# Altium schematic sheet TB-OSW-DRV V1.0.SchDoc
size D
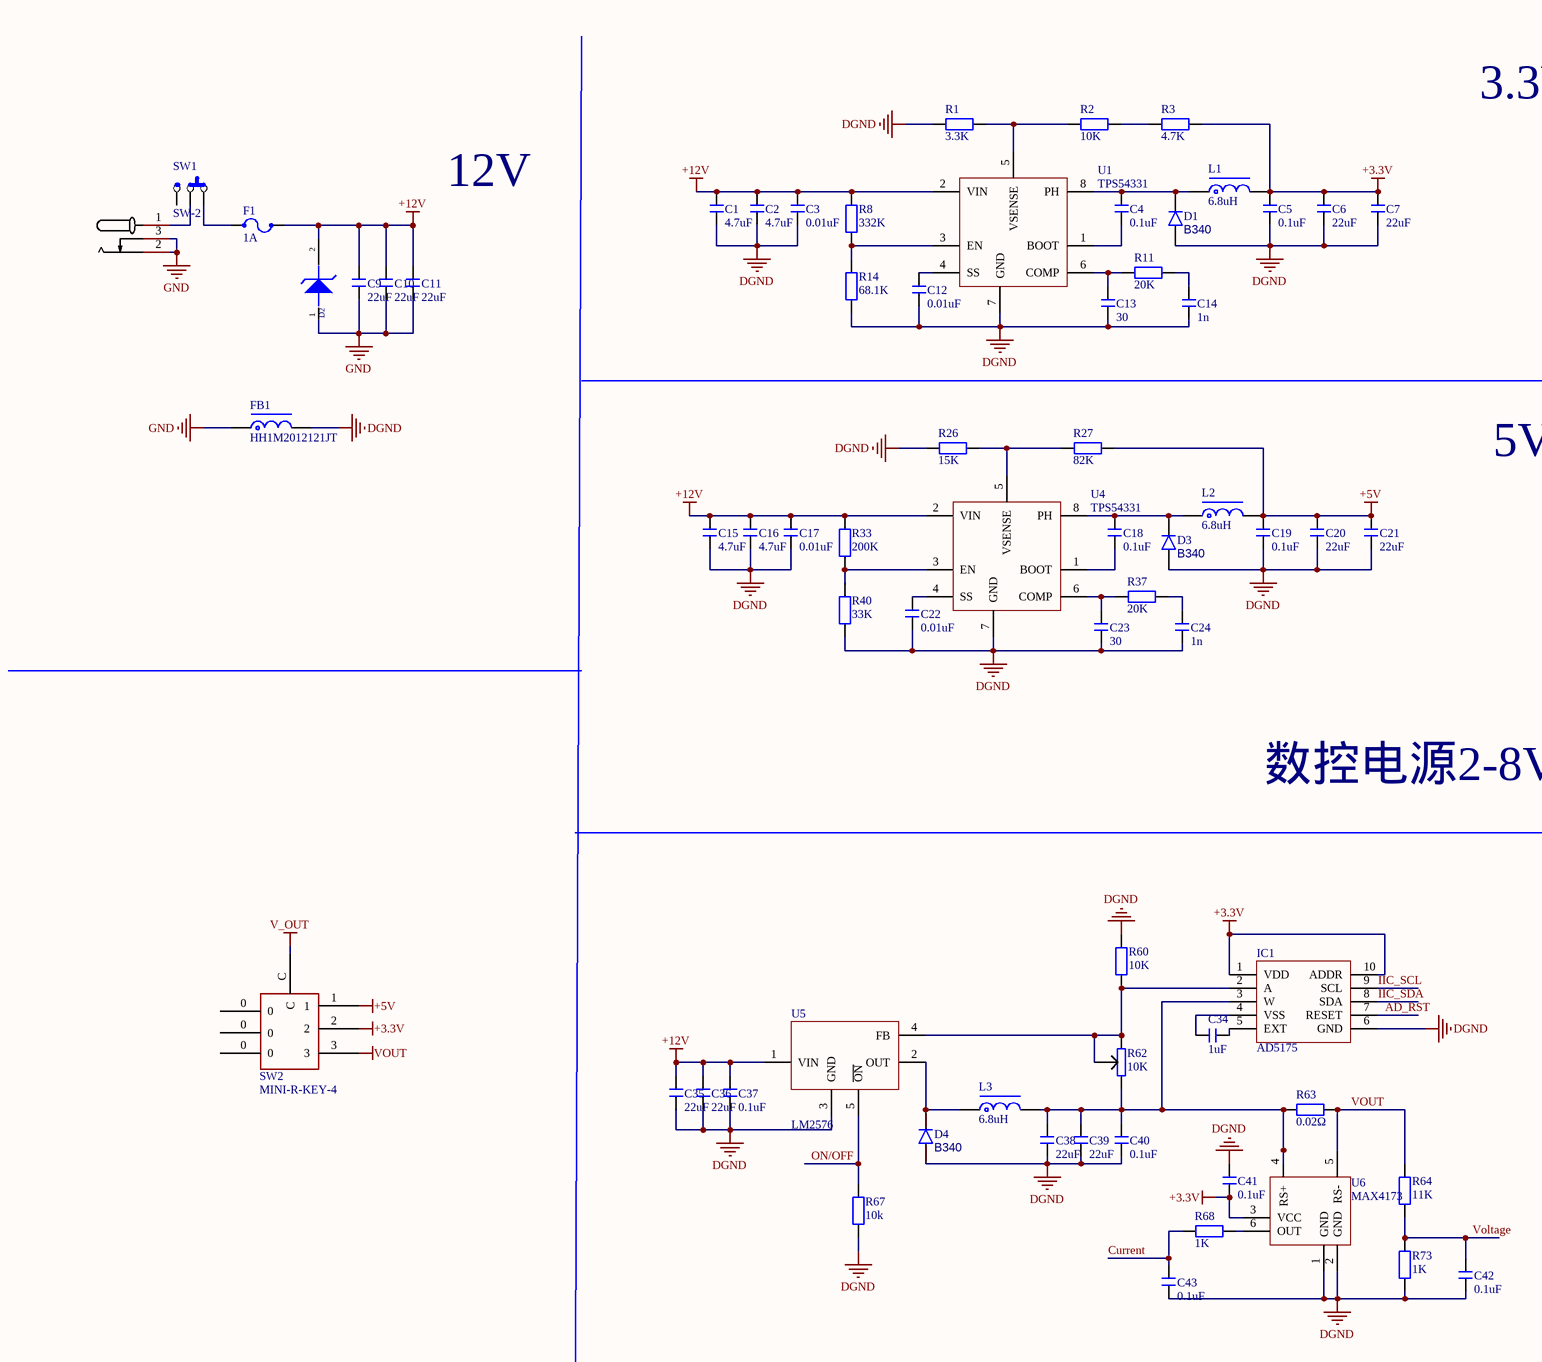
[diagram p0: TB-OSW-DRV V1.0.SchDoc, top left]
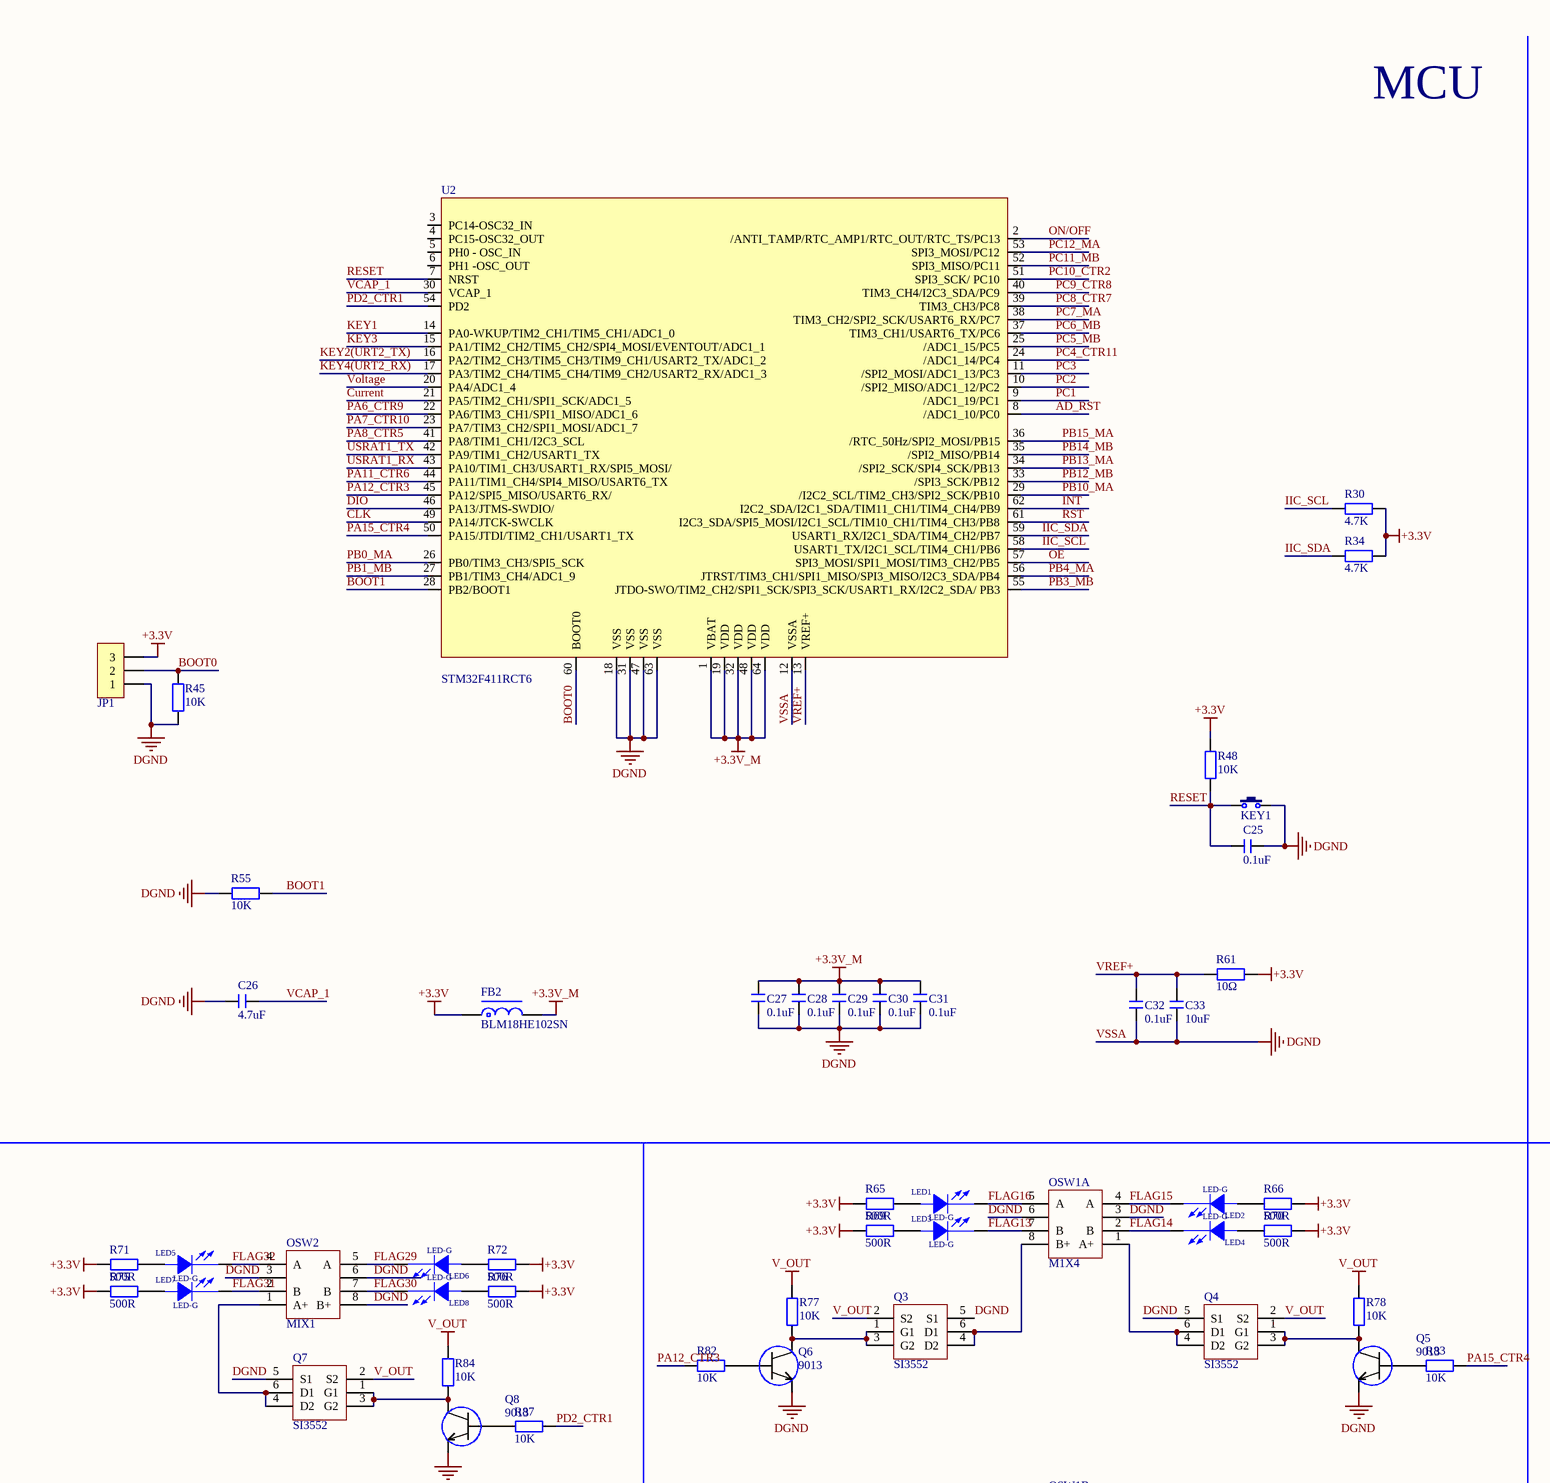
[diagram p1: TB-OSW-DRV V1.0.SchDoc, top middle]
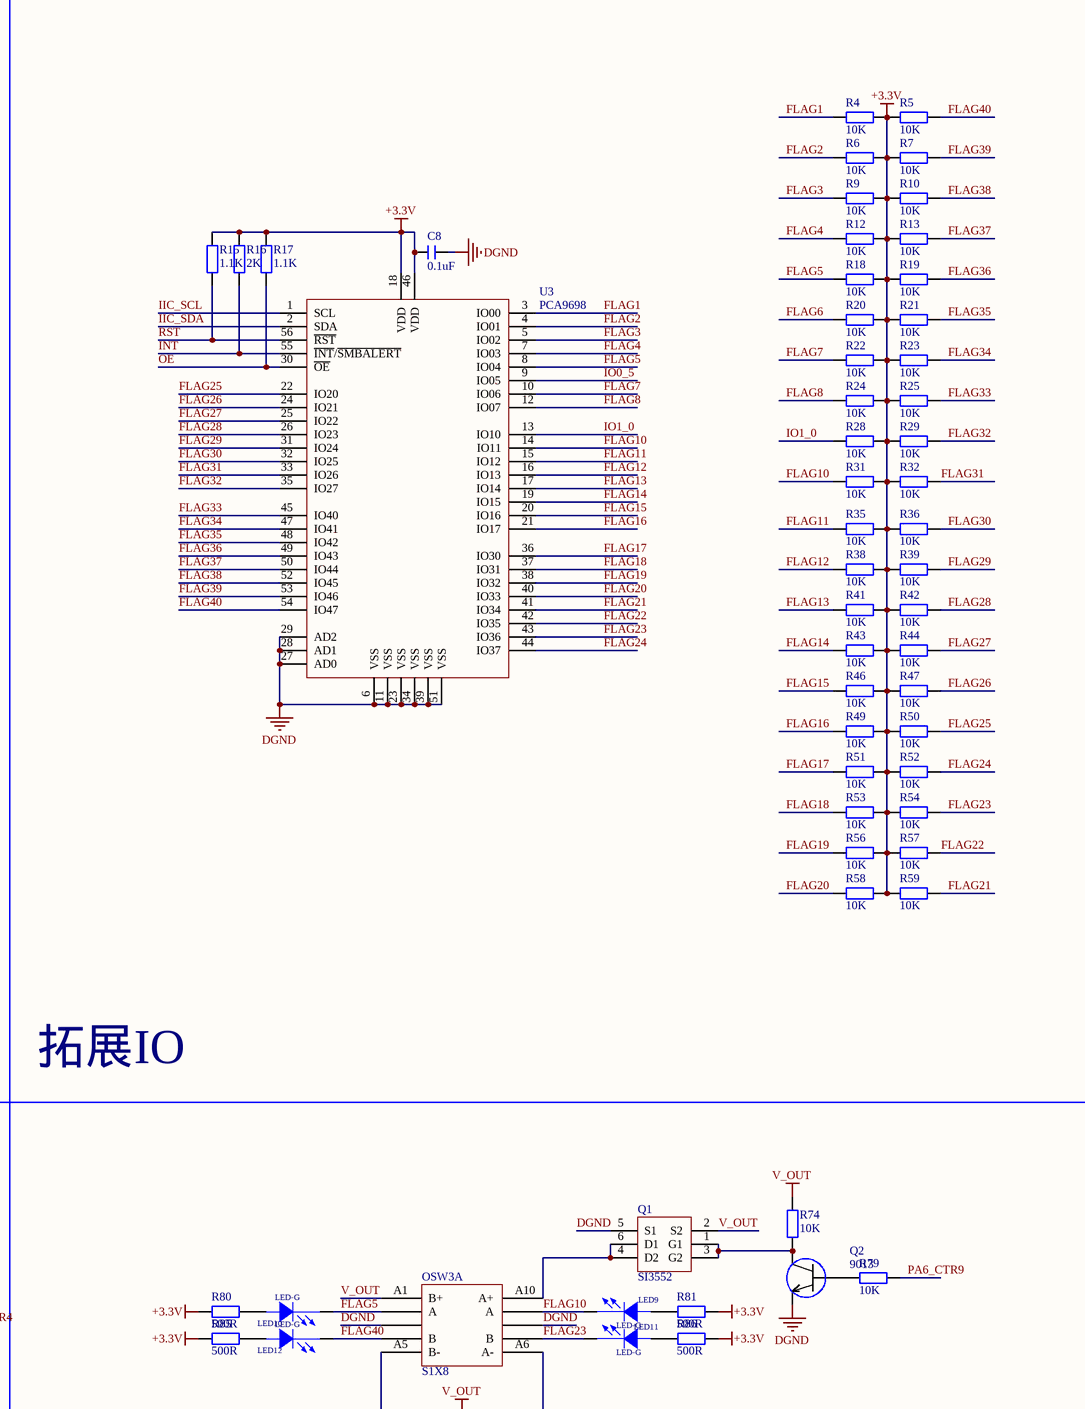
[diagram p2: TB-OSW-DRV V1.0.SchDoc, top right]
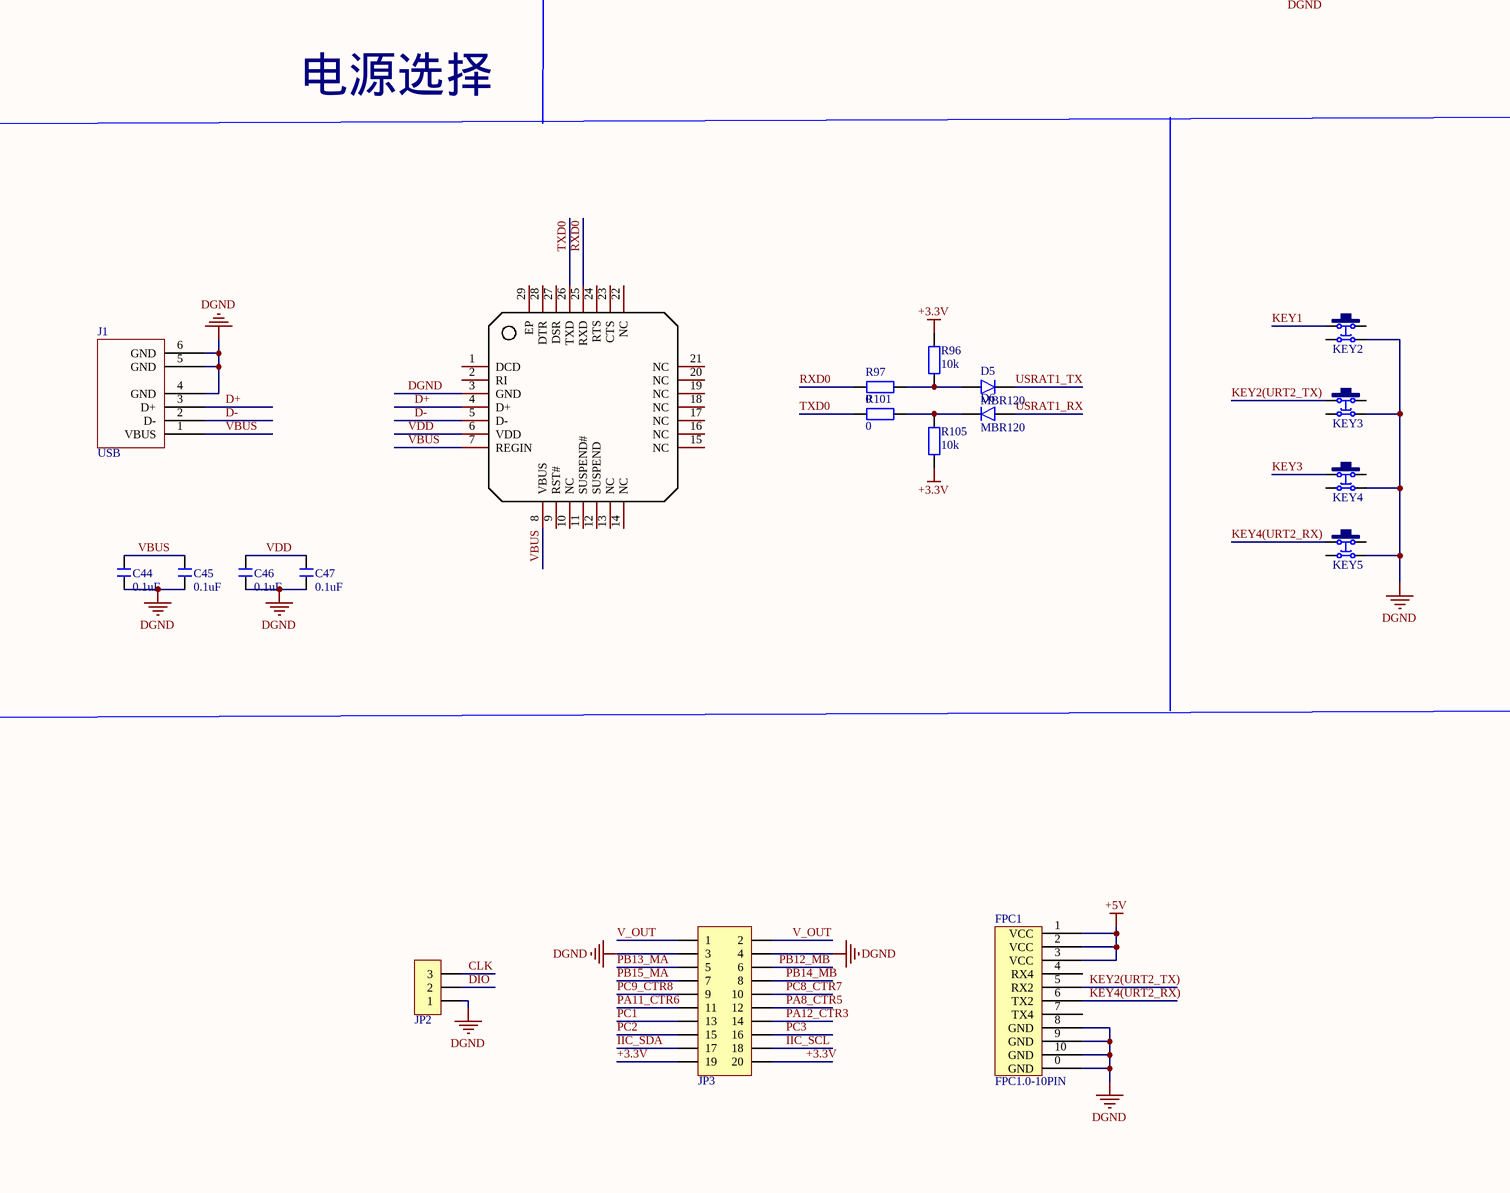
[diagram p3: TB-OSW-DRV V1.0.SchDoc, bottom left]
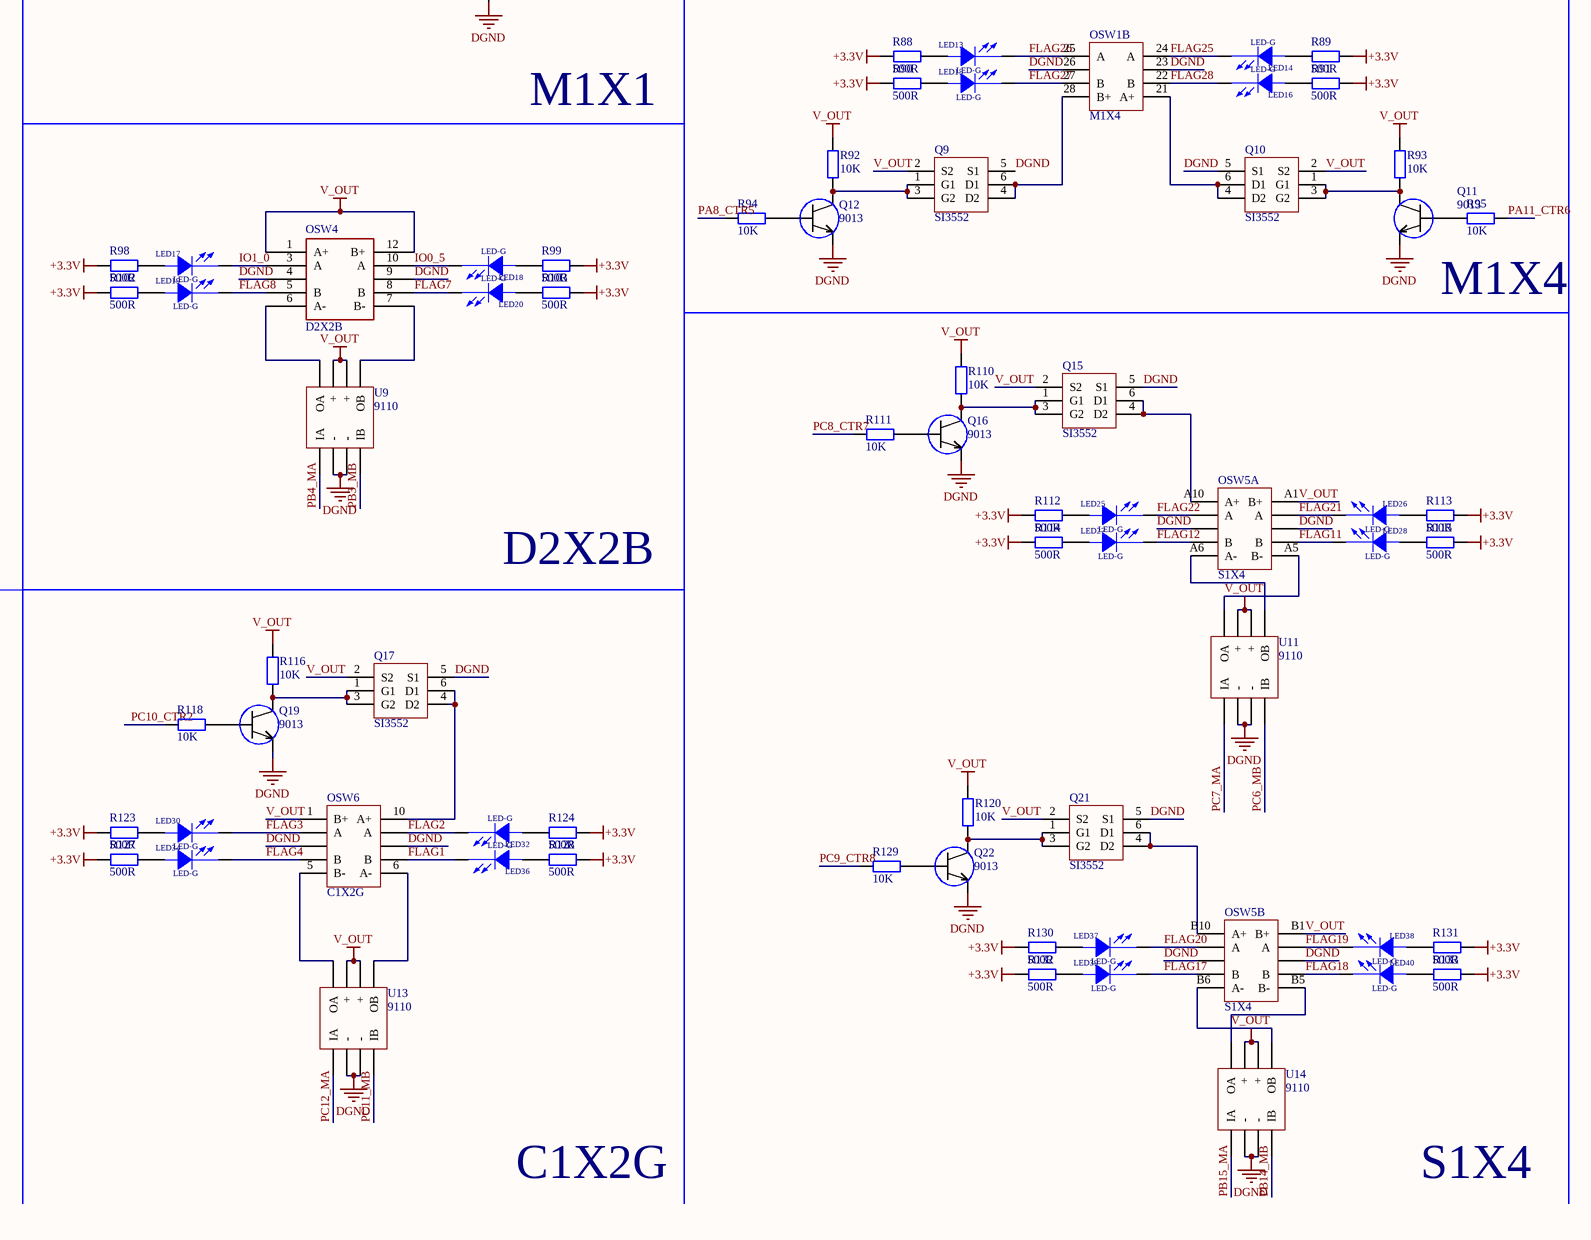
[diagram p4: TB-OSW-DRV V1.0.SchDoc, bottom middle]
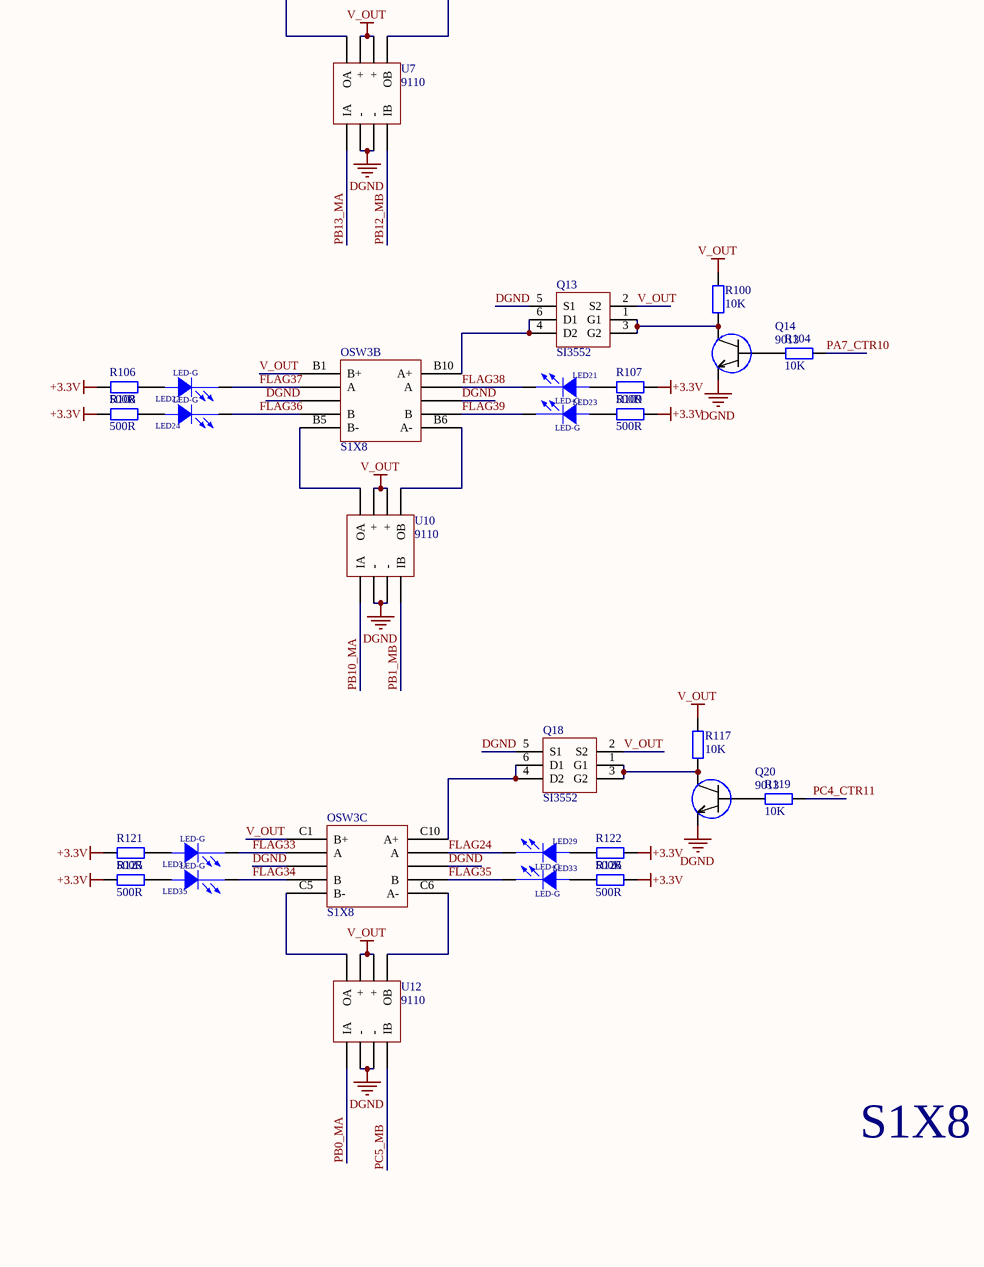
[diagram p5: TB-OSW-DRV V1.0.SchDoc, bottom right]

## Parts
C1  4.7uF  [C 0805]
C2  4.7uF  [C 0805]
C3  0.01uF  [C 0805]
C4  0.1uF  [C 0603]
C5  0.1uF  [C 0603]
C6  22uF  [C 0805]
C7  22uF  [C 0805]
C8  0.1uF  [C 0603]
C9  22uF  [C 1206]
C10  22uF  [C 1206]
C11  22uF  [C 1206]
C12  0.01uF  [C 0603]
C13  30  [C 0603]
C14  1n  [C 0603]
C15  4.7uF  [C 0805]
C16  4.7uF  [C 0805]
C17  0.01uF  [C 0805]
C18  0.1uF  [C 0603]
C19  0.1uF  [C 0603]
C20  22uF  [C 0805]
C21  22uF  [C 0805]
C22  0.01uF  [C 0603]
C23  30  [C 0603]
C24  1n  [C 0603]
C25  0.1uF  [C 0603]
C26  4.7uF  [C 0603]
C27  0.1uF  [C 0603]
C28  0.1uF  [C 0603]
C29  0.1uF  [C 0603]
C30  0.1uF  [C 0603]
C31  0.1uF  [C 0603]
C32  0.1uF  [C 0603]
C33  10uF  [C 0603]
C34  1uF  [C 0603]
C35  22uF  [C 1206]
C36  22uF  [C 1206]
C37  0.1uF  [C 0603]
C38  22uF  [C 0805]
C39  22uF  [C 0805]
C40  0.1uF  [C 0603]
C41  0.1uF  [C 0603]
C42  0.1uF  [C 0603]
C43  0.1uF  [C 0603]
C44  0.1uF  [C 0603]
C45  0.1uF  [C 0603]
C46  0.1uF  [C 0603]
C47  0.1uF  [C 0603]
D1  B340  [d1808]
D2  TVS_SDO5C_SOD-323  [SOD-323]  (value not drawn)
D3  B340  [d1808]
D4  B340  [d1808]
D5  MBR120  [SOD-123]
D6  MBR120  [SOD-123]
DC1  DC005  [DC-IN-TH_DC005]  (value not drawn)
F1  1A  [R1206]
FB1  HH1M2012121JT  [L 0805]
FB2  BLM18HE102SN  [L 0805]
FPC1  FPC1.0-10PIN  [FPC1.0-2H-WS-10P]
IC1  AD5175  [AD5175]
J1  USB  [USB-B]
JP1  HDR-1X3  [HDR-1X3]  (value not drawn)
JP2  HDR-1X3  [HDR-1X3]  (value not drawn)
JP3  Header 2X10  [HDR-10X2]  (value not drawn)
KEY1  3x6x5  [TSW SMD-3*6*2.5]  (value not drawn)
KEY2  12x12x5  [TSW DIP-12*12*11]  (value not drawn)
KEY3  12x12x5  [TSW DIP-12*12*11]  (value not drawn)
KEY4  12x12x5  [TSW DIP-12*12*11]  (value not drawn)
KEY5  12x12x5  [TSW DIP-12*12*11]  (value not drawn)
L1  6.8uH  [CD54]
L2  6.8uH  [CD54]
L3  6.8uH  [CD54]
LED1  value LED-G  [D0603B]  (hidden comment: D_LED-G_D0603)
LED2  value LED-G  [D0603B]  (hidden comment: D_LED-G_D0603)
LED3  value LED-G  [D0603B]  (hidden comment: D_LED-G_D0603)
LED4  value LED-G  [D0603B]  (hidden comment: D_LED-G_D0603)
LED5  value LED-G  [D0603B]  (hidden comment: D_LED-G_D0603)
LED6  value LED-G  [D0603B]  (hidden comment: D_LED-G_D0603)
LED7  value LED-G  [D0603B]  (hidden comment: D_LED-G_D0603)
LED8  value LED-G  [D0603B]  (hidden comment: D_LED-G_D0603)
LED9  value LED-G  [D0603B]  (hidden comment: D_LED-G_D0603)
LED10  value LED-G  [D0603B]  (hidden comment: D_LED-G_D0603)
LED11  value LED-G  [D0603B]  (hidden comment: D_LED-G_D0603)
LED12  value LED-G  [D0603B]  (hidden comment: D_LED-G_D0603)
LED13  value LED-G  [D0603B]  (hidden comment: D_LED-G_D0603)
LED14  value LED-G  [D0603B]  (hidden comment: D_LED-G_D0603)
LED15  value LED-G  [D0603B]  (hidden comment: D_LED-G_D0603)
LED16  value LED-G  [D0603B]  (hidden comment: D_LED-G_D0603)
LED17  value LED-G  [D0603B]  (hidden comment: D_LED-G_D0603)
LED18  value LED-G  [D0603B]  (hidden comment: D_LED-G_D0603)
LED19  value LED-G  [D0603B]  (hidden comment: D_LED-G_D0603)
LED20  value LED-G  [D0603B]  (hidden comment: D_LED-G_D0603)
LED21  value LED-G  [D0603B]  (hidden comment: D_LED-G_D0603)
LED22  value LED-G  [D0603B]  (hidden comment: D_LED-G_D0603)
LED23  value LED-G  [D0603B]  (hidden comment: D_LED-G_D0603)
LED24  value LED-G  [D0603B]  (hidden comment: D_LED-G_D0603)
LED25  value LED-G  [D0603B]  (hidden comment: D_LED-G_D0603)
LED26  value LED-G  [D0603B]  (hidden comment: D_LED-G_D0603)
LED27  value LED-G  [D0603B]  (hidden comment: D_LED-G_D0603)
LED28  value LED-G  [D0603B]  (hidden comment: D_LED-G_D0603)
LED29  value LED-G  [D0603B]  (hidden comment: D_LED-G_D0603)
LED30  value LED-G  [D0603B]  (hidden comment: D_LED-G_D0603)
LED31  value LED-G  [D0603B]  (hidden comment: D_LED-G_D0603)
LED32  value LED-G  [D0603B]  (hidden comment: D_LED-G_D0603)
LED33  value LED-G  [D0603B]  (hidden comment: D_LED-G_D0603)
LED34  value LED-G  [D0603B]  (hidden comment: D_LED-G_D0603)
LED35  value LED-G  [D0603B]  (hidden comment: D_LED-G_D0603)
LED36  value LED-G  [D0603B]  (hidden comment: D_LED-G_D0603)
LED37  value LED-G  [D0603B]  (hidden comment: D_LED-G_D0603)
LED38  value LED-G  [D0603B]  (hidden comment: D_LED-G_D0603)
LED39  value LED-G  [D0603B]  (hidden comment: D_LED-G_D0603)
LED40  value LED-G  [D0603B]  (hidden comment: D_LED-G_D0603)
OSW1  M1X4  [MIN1X4]  (parts A,B of 2)
OSW2  MIX1  [M1X1 - duplicate]
OSW3  S1X8  [S1X8 - duplicate]  (parts A,B,C of 3)
OSW4  D2X2B  [D2X2B - duplicate]
OSW5  S1X4  [S1X4 - duplicate]  (parts A,B of 2)
OSW6  C1X2G  [C1X2G - duplicate]
Q1  SI3552  [3552]
Q2  9013  [SOT-23]
Q3  SI3552  [3552]
Q4  SI3552  [3552]
Q5  9013  [SOT-23]
Q6  9013  [SOT-23]
Q7  SI3552  [3552]
Q8  9013  [SOT-23]
Q9  SI3552  [3552]
Q10  SI3552  [3552]
Q11  9013  [SOT-23]
Q12  9013  [SOT-23]
Q13  SI3552  [3552]
Q14  9013  [SOT-23]
Q15  SI3552  [3552]
Q16  9013  [SOT-23]
Q17  SI3552  [3552]
Q18  SI3552  [3552]
Q19  9013  [SOT-23]
Q20  9013  [SOT-23]
Q21  SI3552  [3552]
Q22  9013  [SOT-23]
R1  3.3K  [R 0603]
R2  10K  [R 0603]
R3  4.7K  [R 0603]
R4  10K  [R 0603]
R5  10K  [R 0603]
R6  10K  [R 0603]
R7  10K  [R 0603]
R8  332K  [R 0603]
R9  10K  [R 0603]
R10  10K  [R 0603]
R11  20K  [R 0603]
R12  10K  [R 0603]
R13  10K  [R 0603]
R14  68.1K  [R 0603]
R15  1.1K  [R 0603]
R16  2K  [R 0603]
R17  1.1K  [R 0603]
R18  10K  [R 0603]
R19  10K  [R 0603]
R20  10K  [R 0603]
R21  10K  [R 0603]
R22  10K  [R 0603]
R23  10K  [R 0603]
R24  10K  [R 0603]
R25  10K  [R 0603]
R26  15K  [R 0603]
R27  82K  [R 0603]
R28  10K  [R 0603]
R29  10K  [R 0603]
R30  4.7K  [R 0603]
R31  10K  [R 0603]
R32  10K  [R 0603]
R33  200K  [R 0603]
R34  4.7K  [R 0603]
R35  10K  [R 0603]
R36  10K  [R 0603]
R37  20K  [R 0603]
R38  10K  [R 0603]
R39  10K  [R 0603]
R40  33K  [R 0603]
R41  10K  [R 0603]
R42  10K  [R 0603]
R43  10K  [R 0603]
R44  10K  [R 0603]
R45  10K  [R 0603]
R46  10K  [R 0603]
R47  10K  [R 0603]
R48  10K  [R 0603]
R49  10K  [R 0603]
R50  10K  [R 0603]
R51  10K  [R 0603]
R52  10K  [R 0603]
R53  10K  [R 0603]
R54  10K  [R 0603]
R55  10K  [R 0603]
R56  10K  [R 0603]
R57  10K  [R 0603]
R58  10K  [R 0603]
R59  10K  [R 0603]
R60  10K  [R 0603]
R61  10Ω  [R 0603]
R62  10K  [3296W]
R63  0.02Ω  [R 1206]
R64  11K  [R 0603]
R65  500R  [R 0603]
R66  500R  [R 0603]
R67  10k  [R 0603]
R68  1K  [R 0603]
R69  500R  [R 0603]
R70  500R  [R 0603]
R71  500R  [R 0603]
R72  500R  [R 0603]
R73  1K  [R 0603]
R74  10K  [R 0603]
R75  500R  [R 0603]
R76  500R  [R 0603]
R77  10K  [R 0603]
R78  10K  [R 0603]
R79  10K  [R 0603]
R80  500R  [R 0603]
R81  500R  [R 0603]
R82  10K  [R 0603]
R83  10K  [R 0603]
R84  10K  [R 0603]
R85  500R  [R 0603]
R86  500R  [R 0603]
R87  10K  [R 0603]
R88  500R  [R 0603]
R89  500R  [R 0603]
R90  500R  [R 0603]
R91  500R  [R 0603]
R92  10K  [R 0603]
R93  10K  [R 0603]
R94  10K  [R 0603]
R95  10K  [R 0603]
R96  10k  [R 0603]
R97  0  [R 0603]
R98  500R  [R 0603]
R99  500R  [R 0603]
R100  10K  [R 0603]
R101  0  [R 0603]
R102  500R  [R 0603]
R103  500R  [R 0603]
R104  10K  [R 0603]
R105  10k  [R 0603]
R106  500R  [R 0603]
R107  500R  [R 0603]
R108  500R  [R 0603]
R109  500R  [R 0603]
R110  10K  [R 0603]
R111  10K  [R 0603]
R112  500R  [R 0603]
R113  500R  [R 0603]
R114  500R  [R 0603]
R115  500R  [R 0603]
R116  10K  [R 0603]
R117  10K  [R 0603]
R118  10K  [R 0603]
R119  10K  [R 0603]
R120  10K  [R 0603]
R121  500R  [R 0603]
R122  500R  [R 0603]
R123  500R  [R 0603]
R124  500R  [R 0603]
R125  500R  [R 0603]
R126  500R  [R 0603]
R127  500R  [R 0603]
R128  500R  [R 0603]
R129  10K  [R 0603]
R130  500R  [R 0603]
R131  500R  [R 0603]
R132  500R  [R 0603]
R133  500R  [R 0603]
SW1  SW-2  [SWSD - V]
SW2  MINI-R-KEY-4  [MINI-R-KEY-4]
U1  TPS54331  [SOP8]
U2  STM32F411RCT6  [TQFP64]
U3  PCA9698  [PCA9698]
U4  TPS54331  [SOP8]
U5  LM2576  [TO-263-5]
U6  MAX4173  [SOT-23-6]
U7  9110  [SOP8]
U8  CP2102-GMR  [WQFN-28_L5.0-W5.0-P0.50-BL-EP3.2]  (value not drawn)
U9  9110  [SOP8]
U10  9110  [SOP8]
U11  9110  [SOP8]
U12  9110  [SOP8]
U13  9110  [SOP8]
U14  9110  [SOP8]

## Nets
+3.3V: C5.1 C6.1 C7.1 C8.2 C41.1 FB2.1 IC1.1(VDD) IC1.10(ADDR) JP1.3 JP3.19 JP3.20 L1.2 R3.2 R4.1 R5.2 R6.1 R7.2 R9.1 R10.2 R12.1 R13.2 R15.1 R16.1 R17.1 R18.1 R19.2 R20.1 R21.2 R22.1 R23.2 R24.1 R25.2 R28.1 R29.2 R30.1 R31.1 R32.2 R34.1 R35.1 R36.2 R38.1 R39.2 R41.1 R42.2 R43.1 R44.2 R46.1 R47.2 R48.2 R49.1 R50.2 R51.1 R52.2 R53.1 R54.2 R56.1 R57.2 R58.1 R59.2 R61.1 R65.2 R66.2 R69.1 R70.1 R71.1 R72.2 R75.2 R76.1 R80.1 R81.2 R85.2 R86.1 R88.2 R89.2 R90.1 R91.1 R96.2 R98.1 R99.2 R102.2 R103.1 R105.1 R106.1 R107.2 R108.2 R109.1 R112.2 R113.2 R114.1 R115.1 R121.1 R122.2 R123.2 R124.2 R125.2 R126.1 R127.1 R128.1 R130.2 R131.2 R132.1 R133.1 SW2.2 U3.18(VDD) U3.46(VDD) U6.3(VCC)
+3.3V_M: C27.1 C28.1 C29.1 C30.1 C31.1 FB2.2 U2.1(VBAT) U2.19(VDD) U2.32(VDD) U2.48(VDD) U2.64(VDD)
+5V: C19.1 C20.1 C21.1 FPC1.1(VCC) FPC1.2(VCC) FPC1.3(VCC) L2.2 R27.2 SW2.1
+12V: C1.1 C2.1 C3.1 C9.1 C10.1 C11.1 C15.1 C16.1 C17.1 C35.1 C36.1 C37.1 D2.2 F1.2 R8.1 R33.1 U1.2(VIN) U4.2(VIN) U5.1(VIN)
DGND: C1.2 C2.2 C3.2 C5.2 C6.2 C7.2 C8.1 C12.2 C13.2 C14.2 C15.2 C16.2 C17.2 C19.2 C20.2 C21.2 C22.2 C23.2 C24.2 C25.1 C26.1 C27.2 C28.2 C29.2 C30.2 C31.2 C32.1 C33.2 C35.2 C36.2 C37.2 C38.2 C39.2 C40.2 C41.2 C42.1 C43.2 C44.1 C45.1 C46.1 C47.1 D1.+ D3.+ D4.+ FB1.2 FPC1.0(GND) FPC1.8(GND) FPC1.9(GND) FPC1.10(GND) IC1.6(GND) J1.4(GND) J1.5(GND) J1.6(GND) JP1.1 JP2.1 JP3.3 JP3.4 KEY1.2 KEY2.3 KEY3.3 KEY4.3 KEY5.3 OSW1.3 OSW1.6 OSW1.23 OSW1.26 OSW2.3 OSW2.6 OSW2.8(B+) OSW3.A3 OSW3.A8 OSW3.B3 OSW3.B8 OSW3.C3 OSW3.C8 OSW4.4 OSW4.9 OSW5.A3 OSW5.A8 OSW5.B3 OSW5.B8 OSW6.3 OSW6.8 Q1.5(S1) Q2.e Q3.5(S1) Q4.5(S1) Q5.e Q6.e Q7.5(S1) Q8.e Q9.5(S1) Q10.5(S1) Q11.e Q12.e Q13.5(S1) Q14.e Q15.5(S1) Q16.e Q17.5(S1) Q18.5(S1) Q19.e Q20.e Q21.5(S1) Q22.e R1.1 R14.2 R26.1 R40.2 R45.2 R55.2 R60.2 R67.1 R73.1 U1.7(GND) U2.12(VSSA) U2.18(VSS) U2.31(VSS) U2.47(VSS) U2.63(VSS) U3.6(VSS) U3.11(VSS) U3.23(VSS) U3.27(AD0) U3.28(AD1) U3.29(AD2) U3.34(VSS) U3.39(VSS) U3.51(VSS) U4.7(GND) U5.3(GND) U6.1(GND) U6.2(GND) U7.5(-) U7.8(-) U8.3(GND) U9.5(-) U9.8(-) U10.5(-) U10.8(-) U11.5(-) U11.8(-) U12.5(-) U12.8(-) U13.5(-) U13.8(-) U14.5(-) U14.8(-)  [also labelled VSSA]
GND: C9.2 C10.2 C11.2 D2.1 DC1.2 DC1.3 FB1.1
V_OUT: JP3.1 JP3.2 OSW3.A1(B+) OSW3.B1(B+) OSW3.C1(B+) OSW4.1(A+) OSW4.12(B+) OSW5.A1(B+) OSW5.B1(B+) OSW6.1(B+) Q1.2(S2) Q3.2(S2) Q4.2(S2) Q7.2(S2) Q9.2(S2) Q10.2(S2) Q13.2(S2) Q15.2(S2) Q17.2(S2) Q18.2(S2) Q21.2(S2) R74.1 R77.1 R78.1 R84.1 R92.1 R93.1 R100.1 R110.1 R116.1 R117.1 R120.1 SW2.C U7.2(+) U7.3(+) U9.2(+) U9.3(+) U10.2(+) U10.3(+) U11.2(+) U11.3(+) U12.2(+) U12.3(+) U13.2(+) U13.3(+) U14.2(+) U14.3(+)
VOUT: R63.2 R64.2 SW2.3 U6.5(RS-)
AD_RST: IC1.7(RESET) U2.8(/ADC1_10/PC0)
BOOT0: JP1.2 R45.1 U2.60(BOOT0)
BOOT1: R55.1 U2.28(PB2/BOOT1)
CLK: JP2.3 U2.49(PA14/JTCK-SWCLK)
Current: C43.1 R68.1 U2.21(PA5/TIM2_CH1/SPI1_SCK/ADC1_5)
D+: J1.3(D+) U8.4(D+)
D-: J1.2(D-) U8.5(D-)
DIO: JP2.2 U2.46(PA13/JTMS-SWDIO/)
FLAG1: LED36.2(CATHODE) OSW6.7(B) R4.2 U3.3(IO00)
FLAG2: LED32.2(CATHODE) OSW6.9(A) R6.2 U3.4(IO01)
FLAG3: LED30.2(CATHODE) OSW6.2(A) R9.2 U3.5(IO02)
FLAG4: LED34.2(CATHODE) OSW6.4(B) R12.2 U3.7(IO03)
FLAG5: LED10.2(CATHODE) OSW3.A2(A) R18.2 U3.8(IO04)
FLAG6: R20.2
FLAG7: LED20.2(CATHODE) OSW4.8(B) R22.2 U3.10(IO06)
FLAG8: LED19.2(CATHODE) OSW4.5(B) R24.2 U3.12(IO07)
FLAG10: LED9.2(CATHODE) OSW3.A9(A) R31.2 U3.14(IO11)
FLAG11: LED28.2(CATHODE) OSW5.A4(B) R35.2 U3.15(IO12)
FLAG12: LED27.2(CATHODE) OSW5.A7(B) R38.2 U3.16(IO13)
FLAG13: LED3.2(CATHODE) OSW1.7(B) R41.2 U3.17(IO14)
FLAG14: LED4.2(CATHODE) OSW1.2(B) R43.2 U3.19(IO15)
FLAG15: LED2.2(CATHODE) OSW1.4(A) R46.2 U3.20(IO16)
FLAG16: LED1.2(CATHODE) OSW1.5(A) R49.2 U3.21(IO17)
FLAG17: LED39.2(CATHODE) OSW5.B7(B) R51.2 U3.36(IO30)
FLAG18: LED40.2(CATHODE) OSW5.B4(B) R53.2 U3.37(IO31)
FLAG19: LED38.2(CATHODE) OSW5.B2(A) R56.2 U3.38(IO32)
FLAG20: LED37.2(CATHODE) OSW5.B9(A) R58.2 U3.40(IO33)
FLAG21: LED26.2(CATHODE) OSW5.A2(A) R59.1 U3.41(IO34)
FLAG22: LED25.2(CATHODE) OSW5.A9(A) R57.1 U3.42(IO35)
FLAG23: LED11.2(CATHODE) OSW3.A7(B) R54.1 U3.43(IO36)
FLAG24: LED29.2(CATHODE) OSW3.C9(A) R52.1 U3.44(IO37)
FLAG25: LED14.2(CATHODE) OSW1.24(A) R50.1 U3.22(IO20)
FLAG26: LED13.2(CATHODE) OSW1.25(A) R47.1 U3.24(IO21)
FLAG27: LED15.2(CATHODE) OSW1.27(B) R44.1 U3.25(IO22)
FLAG28: LED16.2(CATHODE) OSW1.22(B) R42.1 U3.26(IO23)
FLAG29: LED6.2(CATHODE) OSW2.5(A) R39.1 U3.31(IO24)
FLAG30: LED8.2(CATHODE) OSW2.7(B) R36.1 U3.32(IO25)
FLAG31: LED7.2(CATHODE) OSW2.2(B) R32.1 U3.33(IO26)
FLAG32: LED5.2(CATHODE) OSW2.4(A) R29.1 U3.35(IO27)
FLAG33: LED31.2(CATHODE) OSW3.C2(A) R25.1 U3.45(IO40)
FLAG34: LED35.2(CATHODE) OSW3.C4(B) R23.1 U3.47(IO41)
FLAG35: LED33.2(CATHODE) OSW3.C7(B) R21.1 U3.48(IO42)
FLAG36: LED24.2(CATHODE) OSW3.B4(B) R19.1 U3.49(IO43)
FLAG37: LED22.2(CATHODE) OSW3.B2(A) R13.1 U3.50(IO44)
FLAG38: LED21.2(CATHODE) OSW3.B9(A) R10.1 U3.52(IO45)
FLAG39: LED23.2(CATHODE) OSW3.B7(B) R7.1 U3.53(IO46)
FLAG40: LED12.2(CATHODE) OSW3.A4(B) R5.1 U3.54(IO47)
IIC_SCL: IC1.9(SCL) JP3.18 R30.2 U2.58(USART1_TX/I2C1_SCL/TIM4_CH1/PB6) U3.1(SCL)
IIC_SDA: IC1.8(SDA) JP3.17 R34.2 U2.59(USART1_RX/I2C1_SDA/TIM4_CH2/PB7) U3.2(SDA)
INT: R16.2 U2.62(I2C2_SDA/I2C1_SDA/TIM11_CH1/TIM4_CH4/PB9) U3.55(~{INT}/~{SMBALERT})
IO0_5: LED18.2(CATHODE) OSW4.10(A) U3.9(IO05)
IO1_0: LED17.2(CATHODE) OSW4.3(A) R28.2 U3.13(IO10)
KEY1: KEY2.1 U2.14(PA0-WKUP/TIM2_CH1/TIM5_CH1/ADC1_0)
KEY2(URT2_TX): FPC1.5(RX2) KEY3.1 U2.16(PA2/TIM2_CH3/TIM5_CH3/TIM9_CH1/USART2_TX/ADC1_2)
KEY3: KEY4.1 U2.15(PA1/TIM2_CH2/TIM5_CH2/SPI4_MOSI/EVENTOUT/ADC1_1)
KEY4(URT2_RX): FPC1.6(TX2) KEY5.1 U2.17(PA3/TIM2_CH4/TIM5_CH4/TIM9_CH2/USART2_RX/ADC1_3)
OE: R17.2 U2.57(SPI3_MOSI/SPI1_MOSI/TIM3_CH2/PB5) U3.30(~{OE})
ON/OFF: R67.2 U2.2(/ANTI_TAMP/RTC_AMP1/RTC_OUT/RTC_TS/PC13) U5.5(~{ON})
PA6_CTR9: R79.2 U2.22(PA6/TIM3_CH1/SPI1_MISO/ADC1_6)
PA7_CTR10: R104.2 U2.23(PA7/TIM3_CH2/SPI1_MOSI/ADC1_7)
PA8_CTR5: JP3.12 R94.2 U2.41(PA8/TIM1_CH1/I2C3_SCL)
PA11_CTR6: JP3.11 R95.2 U2.44(PA11/TIM1_CH4/SPI4_MISO/USART6_TX)
PA12_CTR3: JP3.14 R82.2 U2.45(PA12/SPI5_MISO/USART6_RX/)
PA15_CTR4: R83.2 U2.50(PA15/JTDI/TIM2_CH1/USART1_TX)
PB0_MA: U2.26(PB0/TIM3_CH3/SPI5_SCK) U12.6(IA)
PB1_MB: U2.27(PB1/TIM3_CH4/ADC1_9) U10.7(IB)
PB3_MB: U2.55(JTDO-SWO/TIM2_CH2/SPI1_SCK/SPI3_SCK/USART1_RX/I2C2_SDA/_PB3) U9.7(IB)
PB4_MA: U2.56(JTRST/TIM3_CH1/SPI1_MISO/SPI3_MISO/I2C3_SDA/PB4) U9.6(IA)
PB10_MA: U2.29(/I2C2_SCL/TIM2_CH3/SPI2_SCK/PB10) U10.6(IA)
PB12_MB: JP3.6 U2.33(/SPI3_SCK/PB12) U7.7(IB)
PB13_MA: JP3.5 U2.34(/SPI2_SCK/SPI4_SCK/PB13) U7.6(IA)
PB14_MB: JP3.8 U2.35(/SPI2_MISO/PB14) U14.7(IB)
PB15_MA: JP3.7 U2.36(/RTC_50Hz/SPI2_MOSI/PB15) U14.6(IA)
PC1: JP3.13 U2.9(/ADC1_19/PC1)
PC2: JP3.15 U2.10(/SPI2_MISO/ADC1_12/PC2)
PC3: JP3.16 U2.11(/SPI2_MOSI/ADC1_13/PC3)
PC4_CTR11: R119.2 U2.24(/ADC1_14/PC4)
PC5_MB: U2.25(/ADC1_15/PC5) U12.7(IB)
PC6_MB: U2.37(TIM3_CH1/USART6_TX/PC6) U11.7(IB)
PC7_MA: U2.38(TIM3_CH2/SPI2_SCK/USART6_RX/PC7) U11.6(IA)
PC8_CTR7: JP3.10 R111.2 U2.39(TIM3_CH3/PC8)
PC9_CTR8: JP3.9 R129.2 U2.40(TIM3_CH4/I2C3_SDA/PC9)
PC10_CTR2: R118.2 U2.51(SPI3_SCK/_PC10)
PC11_MB: U2.52(SPI3_MISO/PC11) U13.7(IB)
PC12_MA: U2.53(SPI3_MOSI/PC12) U13.6(IA)
PD2_CTR1: R87.2 U2.54(PD2)
RESET: C25.2 KEY1.1 R48.1 U2.7(NRST)
RST: R15.2 U2.61(I2C3_SDA/SPI5_MOSI/I2C1_SCL/TIM10_CH1/TIM4_CH3/PB8) U3.56(~{RST})
RXD0: R97.2 U8.25(RXD)
TXD0: R101.2 U8.26(TXD)
USRAT1_RX: D6.- U2.43(PA10/TIM1_CH3/USART1_RX/SPI5_MOSI/)
USRAT1_TX: D5.+ U2.42(PA9/TIM1_CH2/USART1_TX)
VBUS: C44.2 C45.2 J1.1(VBUS) U8.7(REGIN) U8.8(VBUS)
VCAP_1: C26.2 U2.30(VCAP_1)
VDD: C46.2 C47.2 U8.6(VDD)
Voltage: C42.2 R64.1 R73.2 U2.20(PA4/ADC1_4)
VREF+: C32.2 C33.1 R61.2 U2.13(VREF+)
NetC4_1: C4.1 D1.- L1.1 U1.8(PH)
NetC4_2: C4.2 U1.1(BOOT)
NetC12_1: C12.1 U1.4(SS)
NetC13_1: C13.1 R11.1 U1.6(COMP)
NetC14_1: C14.1 R11.2
NetC18_1: C18.1 D3.- L2.1 U4.8(PH)
NetC18_2: C18.2 U4.1(BOOT)
NetC22_1: C22.1 U4.4(SS)
NetC23_1: C23.1 R37.1 U4.6(COMP)
NetC24_1: C24.1 R37.2
NetC34_1: C34.1 IC1.4(VSS)
NetC34_2: C34.2 IC1.5(EXT)
NetC38_1: C38.1 C39.1 C40.1 IC1.3(W) L3.2 R62.3 R63.1 U6.4(RS+)
NetD4_-: D4.- L3.1 U5.2(OUT)
NetD5_-: D5.- R96.1 R97.1
NetD6_+: D6.+ R101.1 R105.2
NetDC1_1: DC1.1 SW1.1
NetF1_1: F1.1 SW1.2
NetIC1_2: IC1.2(A) R60.1 R62.1 R62.2 U5.4(FB)
NetLED1_1: LED1.1(ANODE) R65.1
NetLED2_1: LED2.1(ANODE) R66.1
NetLED3_1: LED3.1(ANODE) R69.2
NetLED4_1: LED4.1(ANODE) R70.2
NetLED5_1: LED5.1(ANODE) R71.2
NetLED6_1: LED6.1(ANODE) R72.1
NetLED7_1: LED7.1(ANODE) R75.1
NetLED8_1: LED8.1(ANODE) R76.2
NetLED9_1: LED9.1(ANODE) R81.1
NetLED10_1: LED10.1(ANODE) R80.2
NetLED11_1: LED11.1(ANODE) R86.2
NetLED12_1: LED12.1(ANODE) R85.1
NetLED13_1: LED13.1(ANODE) R88.1
NetLED14_1: LED14.1(ANODE) R89.1
NetLED15_1: LED15.1(ANODE) R90.2
NetLED16_1: LED16.1(ANODE) R91.2
NetLED17_1: LED17.1(ANODE) R98.2
NetLED18_1: LED18.1(ANODE) R99.1
NetLED19_1: LED19.1(ANODE) R102.1
NetLED20_1: LED20.1(ANODE) R103.2
NetLED21_1: LED21.1(ANODE) R107.1
NetLED22_1: LED22.1(ANODE) R106.2
NetLED23_1: LED23.1(ANODE) R109.2
NetLED24_1: LED24.1(ANODE) R108.1
NetLED25_1: LED25.1(ANODE) R112.1
NetLED26_1: LED26.1(ANODE) R113.1
NetLED27_1: LED27.1(ANODE) R114.2
NetLED28_1: LED28.1(ANODE) R115.2
NetLED29_1: LED29.1(ANODE) R122.1
NetLED30_1: LED30.1(ANODE) R123.1
NetLED31_1: LED31.1(ANODE) R121.2
NetLED32_1: LED32.1(ANODE) R124.1
NetLED33_1: LED33.1(ANODE) R126.2
NetLED34_1: LED34.1(ANODE) R127.2
NetLED35_1: LED35.1(ANODE) R125.1
NetLED36_1: LED36.1(ANODE) R128.2
NetLED37_1: LED37.1(ANODE) R130.1
NetLED38_1: LED38.1(ANODE) R131.1
NetLED39_1: LED39.1(ANODE) R132.2
NetLED40_1: LED40.1(ANODE) R133.2
NetOSW1_1: OSW1.1(A+) Q4.4(D2) Q4.6(D1)
NetOSW1_8: OSW1.8(B+) Q3.4(D2) Q3.6(D1)
NetOSW1_21: OSW1.21(A+) Q10.4(D2) Q10.6(D1)
NetOSW1_28: OSW1.28(B+) Q9.4(D2) Q9.6(D1)
NetOSW2_1: OSW2.1(A+) Q7.4(D2) Q7.6(D1)
NetOSW3_A5: OSW3.A5(B-) U7.1(OA)
NetOSW3_A6: OSW3.A6(A-) U7.4(OB)
NetOSW3_A10: OSW3.A10(A+) Q1.4(D2) Q1.6(D1)
NetOSW3_B5: OSW3.B5(B-) U10.1(OA)
NetOSW3_B6: OSW3.B6(A-) U10.4(OB)
NetOSW3_B10: OSW3.B10(A+) Q13.4(D2) Q13.6(D1)
NetOSW3_C5: OSW3.C5(B-) U12.1(OA)
NetOSW3_C6: OSW3.C6(A-) U12.4(OB)
NetOSW3_C10: OSW3.C10(A+) Q18.4(D2) Q18.6(D1)
NetOSW4_6: OSW4.6(A-) U9.1(OA)
NetOSW4_7: OSW4.7(B-) U9.4(OB)
NetOSW5_A5: OSW5.A5(B-) U11.1(OA)
NetOSW5_A6: OSW5.A6(A-) U11.4(OB)
NetOSW5_A10: OSW5.A10(A+) Q15.4(D2) Q15.6(D1)
NetOSW5_B5: OSW5.B5(B-) U14.1(OA)
NetOSW5_B6: OSW5.B6(A-) U14.4(OB)
NetOSW5_B10: OSW5.B10(A+) Q21.4(D2) Q21.6(D1)
NetOSW6_5: OSW6.5(B-) U13.1(OA)
NetOSW6_6: OSW6.6(A-) U13.4(OB)
NetOSW6_10: OSW6.10(A+) Q17.4(D2) Q17.6(D1)
NetQ1_1: Q1.1(G1) Q1.3(G2) Q2.c R74.2
NetQ2_b: Q2.b R79.1
NetQ3_1: Q3.1(G1) Q3.3(G2) Q6.c R77.2
NetQ4_1: Q4.1(G1) Q4.3(G2) Q5.c R78.2
NetQ5_b: Q5.b R83.1
NetQ6_b: Q6.b R82.1
NetQ7_1: Q7.1(G1) Q7.3(G2) Q8.c R84.2
NetQ8_b: Q8.b R87.1
NetQ9_1: Q9.1(G1) Q9.3(G2) Q12.c R92.2
NetQ10_1: Q10.1(G1) Q10.3(G2) Q11.c R93.2
NetQ11_b: Q11.b R95.1
NetQ12_b: Q12.b R94.1
NetQ13_1: Q13.1(G1) Q13.3(G2) Q14.c R100.2
NetQ14_b: Q14.b R104.1
NetQ15_1: Q15.1(G1) Q15.3(G2) Q16.c R110.2
NetQ16_b: Q16.b R111.1
NetQ17_1: Q17.1(G1) Q17.3(G2) Q19.c R116.2
NetQ18_1: Q18.1(G1) Q18.3(G2) Q20.c R117.2
NetQ19_b: Q19.b R118.1
NetQ20_b: Q20.b R119.1
NetQ21_1: Q21.1(G1) Q21.3(G2) Q22.c R120.2
NetQ22_b: Q22.b R129.1
NetR1_2: R1.2 R2.1 U1.5(VSENSE)
NetR2_2: R2.2 R3.1
NetR8_2: R8.2 R14.1 U1.3(EN)
NetR26_2: R26.2 R27.1 U4.5(VSENSE)
NetR33_2: R33.2 R40.1 U4.3(EN)
NetR68_2: R68.2 U6.6(OUT)

Not connected (* = marked no-connect by the designer): FPC1 4(RX4) 7(TX4); KEY2 2 4; KEY3 2 4; KEY4 2 4; KEY5 2 4; SW1 3; SW2 0; U2 3(PC14-OSC32_IN) 4(PC15-OSC32_OUT) 5(PH0_-_OSC_IN) 6(PH1_-OSC_OUT); U8 1(DCD) 2(RI) 9(RST#) 10(NC) 11(SUSPEND#) 12(SUSPEND) 13(NC) 14(NC) 15(NC) 16(NC) 17(NC) 18(NC) 19(NC) 20(NC) 21(NC) 22(NC) 23(CTS) 24(RTS) 27(DSR) 28(DTR) 29(EP)

## Notes on the sheet
- 3.3V
- MCU
- 12V
- 5V
- 数控电源2-8V
- 拓展IO
- 电源选择
- M1X1
- M1X4
- D2X2B
- S1X8
- C1X2G
- S1X4
- Title
- Size:
- Date:
- File:
- D
- Number:
- Time:
- Revision:
- Sheet
- of

## Library data of the parts
C1-C47 = C: 无极性贴片电容; 版权归属: 源创客; BOM名称: 无极性贴片电容; 学习资源: www.ooocke.com
D1 D3 D4 = DIODE
D2 = TVS_SDO5C_SOD-323: 1455000041; Name: 贴片防静电管SD05C S0D-323  ST; Value: SD05C; Location: TOP; PCB DECAL: SOD-323
D5 D6 = MRB120
DC1 = DC005: Manufacturer: SHOU HAN(首韩); Symbol: DC005_C431533; Add into BOM: yes; Connector Type: DC电源插座; Inside Contact Diameter: 2mm; Outside Contact Diameter: 6.3mm; Current Rating (Max): 500mA; Voltage Rating (Max): 30V; Name: DC005; Device: DC005; LCSC Part Name: DC电源插座 内径:2mm 外径:6.3mm 铁材质; Supplier Part: C431533; Manufacturer Part: DC005; Supplier Footprint: 插件; JLCPCB Part Class: Extended Part; Datasheet: https://atta.szlcsc.com/upload/public/pdf/source/20190925/C431533_4751811035784AC1D38EBC85F7905E99.pdf; Supplier: LCSC; Convert to PCB: yes; Mounting Style: 弯插; Operating Temperature Range: -40℃~+55℃
F1 = FUSE
FB1 FB2 = L: 小功率贴片电感; 版权归属: 源创客; BOM名称: 小功率贴片电感; 学习资源: www.ooocke.com
FPC1 = 2.4迪文串口屏
JP1 JP2 = Header 3: 3P接插件; 版权归属: 源创客; BOM名称: 3P接插件; 学习资源: www.ooocke.com
JP3 = Header 10X2: 10*2P接插件; 版权归属: 源创客; BOM名称: 10*2P接插件; 学习资源: www.ooocke.com
KEY1 = TSW 3x6: 3x6轻触开关; 版权归属: 源创客; BOM名称: 3x6轻触开关; 学习资源: www.ooocke.com
KEY2-KEY5 = TSW DIP-12x12: 直插12x12轻触开关; 版权归属: 源创客; BOM名称: 直插12x12轻触开关; 学习资源: www.ooocke.com
L1-L3 = L-CD: 贴片功率电感; BOM名称: 功率电感; 版权归属: 源创客; 学习资源: www.ooocke.com
LED1-LED40 = D_LED-G_D0603: 5110400395; Location: TOP; Name: 贴片发光二极管(绿光) 0603 普亮; PCB DECAL: D0603B
OSW1 = OSWM2
OSW2 = OSWM1
OSW3 = OSW3
OSW5 = OSW2
OSW6 = OSW1
Q2 Q5 Q6 Q8 Q11 Q12 Q14 Q16 Q19 Q20 Q22 = S9013_SOT23: K3: 1.04.06.10024
R1-R61 R63-R133 = R: 贴片电阻; 版权归属: 源创客; BOM名称: 贴片电阻; 学习资源: www.ooocke.com
R62 = RES-V
U1 U4 = TPS54331_SOP8: K3: 1.04.06.20100
U2 = STM32F411_64
U3 = PCA9698_: K3: 1.04.06.20115
U6 = MAX4173_SOT23-6: K3: 1.04.06.20185
U7 U9-U14 = L9110S_SOP8: K3: 1.04.06.20090
U8 = CP2102-GMR: Manufacturer: SILICON LABS(芯科); Add into BOM: yes; Applications Function: 收发器; Protocol: USB; Data Rate: 1Mbps; Supply Voltage: 3V~3.6V; Name: CP2102-GMR; Symbol: CP2102-GMR; Device: CP2102-GMR; LCSC Part Name: CP2102-GMR; Supplier Part: C6568; Manufacturer Part: CP2102-GMR; Supplier Footprint: WQFN-28-EP(5x5); JLCPCB Part Class: Basic Part; Datasheet: https://atta.szlcsc.com/upload/public/pdf/source/20170103/1483439882795.pdf; Supplier: LCSC; Convert to PCB: yes